# Altium schematic sheet 02_FPGA-jtag.SchDoc
size A4
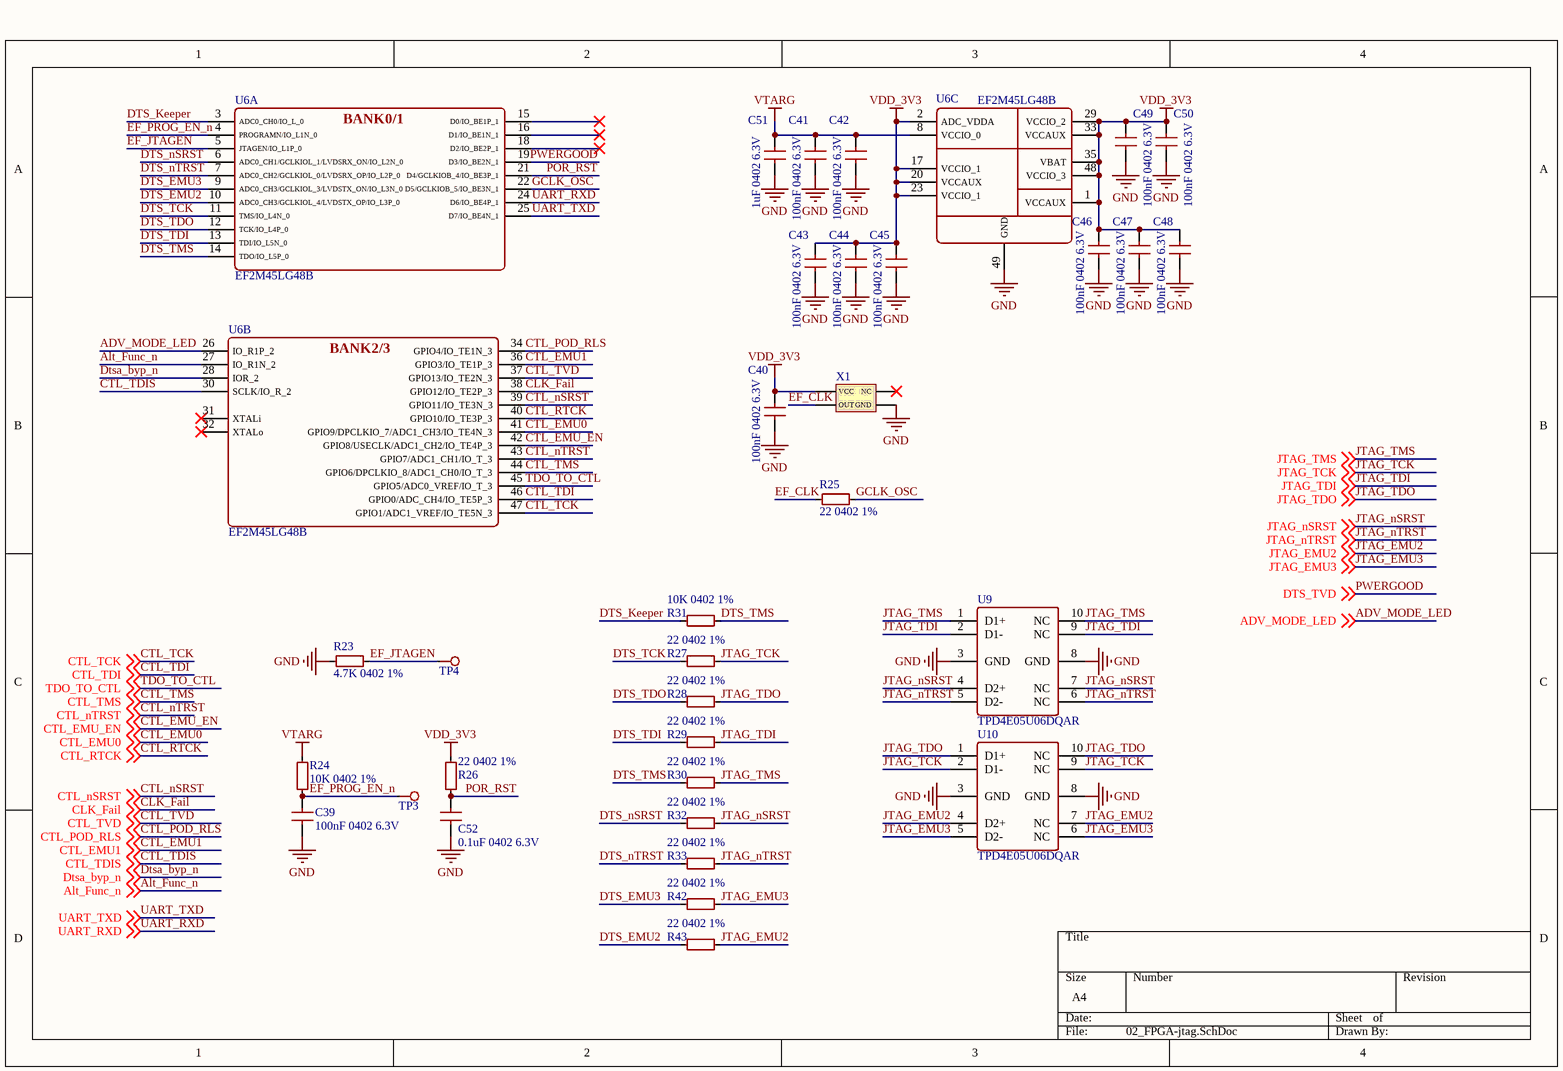
[diagram p0: 02_FPGA-jtag.SchDoc]

## Parts
C39  100nF 0402 6.3V  [C_0402_1005Metric]
C40  100nF 0402 6.3V  [C_0402_1005Metric]
C41  100nF 0402 6.3V  [C_0402_1005Metric]
C42  100nF 0402 6.3V  [C_0402_1005Metric]
C43  100nF 0402 6.3V  [C_0402_1005Metric]
C44  100nF 0402 6.3V  [C_0402_1005Metric]
C45  100nF 0402 6.3V  [C_0402_1005Metric]
C46  100nF 0402 6.3V  [C_0402_1005Metric]
C47  100nF 0402 6.3V  [C_0402_1005Metric]
C48  100nF 0402 6.3V  [C_0402_1005Metric]
C49  100nF 0402 6.3V  [C_0402_1005Metric]
C50  100nF 0402 6.3V  [C_0402_1005Metric]
C51  1uF 0402 6.3V  [C_0402_1005Metric]
C52  0.1uF 0402 6.3V  [C_0402_1005Metric]
R23  4.7K 0402 1%  [R_0402_1005Metric]
R24  10K 0402 1%  [R_0402_1005Metric]
R25  22 0402 1%  [R_0402_1005Metric]
R26  22 0402 1%  [R_0402_1005Metric]
R27  22 0402 1%  [R_0402_1005Metric]
R28  22 0402 1%  [R_0402_1005Metric]
R29  22 0402 1%  [R_0402_1005Metric]
R30  22 0402 1%  [R_0402_1005Metric]
R31  10K 0402 1%  [R_0402_1005Metric]
R32  22 0402 1%  [R_0402_1005Metric]
R33  22 0402 1%  [R_0402_1005Metric]
R42  22 0402 1%  [R_0402_1005Metric]
R43  22 0402 1%  [R_0402_1005Metric]
TP3  TestPoint  [TP-60MIL]  (value not drawn)
TP4  TestPoint  [TP-60MIL]  (value not drawn)
U6  EF2M45LG48B  [EF2M45_LQFP-48L]  (parts A,B,C of 3)
U9  TPD4E05U06DQAR  [TPD4E05U06DQAR]
U10  TPD4E05U06DQAR  [TPD4E05U06DQAR]
X1  Crystal-4Pin-Active-GND2-NC1  [Crystal-Active_SMD_3225-4Pin_3.2x2.5mm]  (value not drawn)

## Nets
GND: C39.1 C40.2 C41.2 C42.2 C43.2 C44.2 C45.2 C46.2 C47.2 C48.2 C49.2 C50.2 C51.2 C52.2 R23.2 U6.49(GND) U9.3(GND) U9.8(GND) U10.3(GND) U10.8(GND) X1.2(GND)
VDD_3V3: C40.1 C43.1 C44.1 C45.1 C46.1 C47.1 C48.1 C49.1 C50.1 R26.2 U6.1(VCCAUX) U6.2(ADC_VDDA) U6.17(VCCIO_1) U6.20(VCCAUX) U6.23(VCCIO_1) U6.29(VCCIO_2) U6.33(VCCAUX) U6.35(VBAT) U6.48(VCCIO_3) X1.4(VCC)
VTARG: C41.1 C42.1 C51.1 R24.1 U6.8(VCCIO_0)
ADV_MODE_LED: U6.26(IO_R1P_2) ; off-sheet ADV_MODE_LED
Alt_Func_n: U6.27(IO_R1N_2) ; off-sheet Alt_Func_n
CLK_Fail: U6.38(GPIO12/IO_TE2P_3) ; off-sheet CLK_Fail
CTL_EMU0: U6.41(GPIO9/DPCLKIO_7/ADC1_CH3/IO_TE4N_3) ; off-sheet CTL_EMU0
CTL_EMU1: U6.36(GPIO3/IO_TE1P_3) ; off-sheet CTL_EMU1
CTL_EMU_EN: U6.42(GPIO8/USECLK/ADC1_CH2/IO_TE4P_3) ; off-sheet CTL_EMU_EN
CTL_nSRST: U6.39(GPIO11/IO_TE3N_3) ; off-sheet CTL_nSRST
CTL_nTRST: U6.43(GPIO7/ADC1_CH1/IO_T_3) ; off-sheet CTL_nTRST
CTL_POD_RLS: U6.34(GPIO4/IO_TE1N_3) ; off-sheet CTL_POD_RLS
CTL_RTCK: U6.40(GPIO10/IO_TE3P_3) ; off-sheet CTL_RTCK
CTL_TCK: U6.47(GPIO1/ADC1_VREF/IO_TE5N_3) ; off-sheet CTL_TCK
CTL_TDI: U6.46(GPIO0/ADC_CH4/IO_TE5P_3) ; off-sheet CTL_TDI
CTL_TDIS: U6.30(SCLK/IO_R_2) ; off-sheet CTL_TDIS
CTL_TMS: U6.44(GPIO6/DPCLKIO_8/ADC1_CH0/IO_T_3) ; off-sheet CTL_TMS
CTL_TVD: U6.37(GPIO13/IO_TE2N_3) ; off-sheet CTL_TVD
DTS_EMU2: R43.2 U6.10(ADC0_CH3/GCLKIOL_4/LVDSTX_OP/IO_L3P_0)
DTS_EMU3: R42.2 U6.9(ADC0_CH3/GCLKIOL_3/LVDSTX_ON/IO_L3N_0)
DTS_Keeper: R31.2 U6.3(ADC0_CH0/IO_L_0)
DTS_nSRST: R32.2 U6.6(ADC0_CH1/GCLKIOL_1/LVDSRX_ON/IO_L2N_0)
DTS_nTRST: R33.2 U6.7(ADC0_CH2/GCLKIOL_0/LVDSRX_OP/IO_L2P_0)
DTS_TCK: R27.2 U6.11(TMS/IO_L4N_0)
DTS_TDI: R29.2 U6.13(TDI/IO_L5N_0)
DTS_TDO: R28.2 U6.12(TCK/IO_L4P_0)
DTS_TMS: R30.2 R31.1 U6.14(TDO/IO_L5P_0)
Dtsa_byp_n: U6.28(IOR_2) ; off-sheet Dtsa_byp_n
EF_CLK: R25.1 X1.3(OUT)
EF_JTAGEN: R23.1 TP4.1 U6.5(JTAGEN/IO_L1P_0)
EF_PROG_EN_n: C39.2 R24.2 TP3.1 U6.4(PROGRAMN/IO_L1N_0)
GCLK_OSC: R25.2 U6.22(D5/GCLKIOB_5/IO_BE3N_1)
JTAG_EMU2: R43.1 U10.4(D2+) U10.7(NC) ; off-sheet JTAG_EMU2
JTAG_EMU3: R42.1 U10.5(D2-) U10.6(NC) ; off-sheet JTAG_EMU3
JTAG_nSRST: R32.1 U9.4(D2+) U9.7(NC) ; off-sheet JTAG_nSRST
JTAG_nTRST: R33.1 U9.5(D2-) U9.6(NC) ; off-sheet JTAG_nTRST
JTAG_TCK: R27.1 U10.2(D1-) U10.9(NC) ; off-sheet JTAG_TCK
JTAG_TDI: R29.1 U9.2(D1-) U9.9(NC) ; off-sheet JTAG_TDI
JTAG_TDO: R28.1 U10.1(D1+) U10.10(NC) ; off-sheet JTAG_TDO
JTAG_TMS: R30.1 U9.1(D1+) U9.10(NC) ; off-sheet JTAG_TMS
POR_RST: C52.1 R26.1 U6.21(D4/GCLKIOB_4/IO_BE3P_1)
PWERGOOD: U6.19(D3/IO_BE2N_1) ; off-sheet DTS_TVD  [also labelled DTS_TVD]
TDO_TO_CTL: U6.45(GPIO5/ADC0_VREF/IO_T_3) ; off-sheet TDO_TO_CTL
UART_RXD: U6.24(D6/IO_BE4P_1) ; off-sheet UART_RXD
UART_TXD: U6.25(D7/IO_BE4N_1) ; off-sheet UART_TXD

Not connected (* = marked no-connect by the designer): U6 15(D0/IO_BE1P_1)* 16(D1/IO_BE1N_1)* 18(D2/IO_BE2P_1)* 31(XTALi)* 32(XTALo)*; X1 1(NC)*

## Notes on the sheet
- (in symbol EF2M45LG48B, part A) BANK0/1
- (in symbol EF2M45LG48B, part B) BANK2/3

## Library data of the parts
C39-C52 = C: Unpolarized capacitor
R23-R33 R42 R43 = R: Resistor
TP3 TP4 = TestPoint: test point tp
U6 = EF2M45LG48B: SALELF® 2 系列 FPGA
U9 U10 = TPD4E05U06DQAR: No Description Available; Mfr_Name: Texas Instruments; CompType: IC; TYPE: TYPE; RefDes: RefDes; Application_BuildNumber: *; PartNumber: TPD4E05U06DQAR; PackageReference: DQA0010A; MountType: SMT; RoHS: Y; Manufacturer: Texas Instruments
X1 = Crystal-4Pin-Active-GND2-NC1: 4 pin crystal,1 for NC,2 for GND